# Altium schematic sheet ASM001-design-3.SchDoc
size 558 x 431 mm
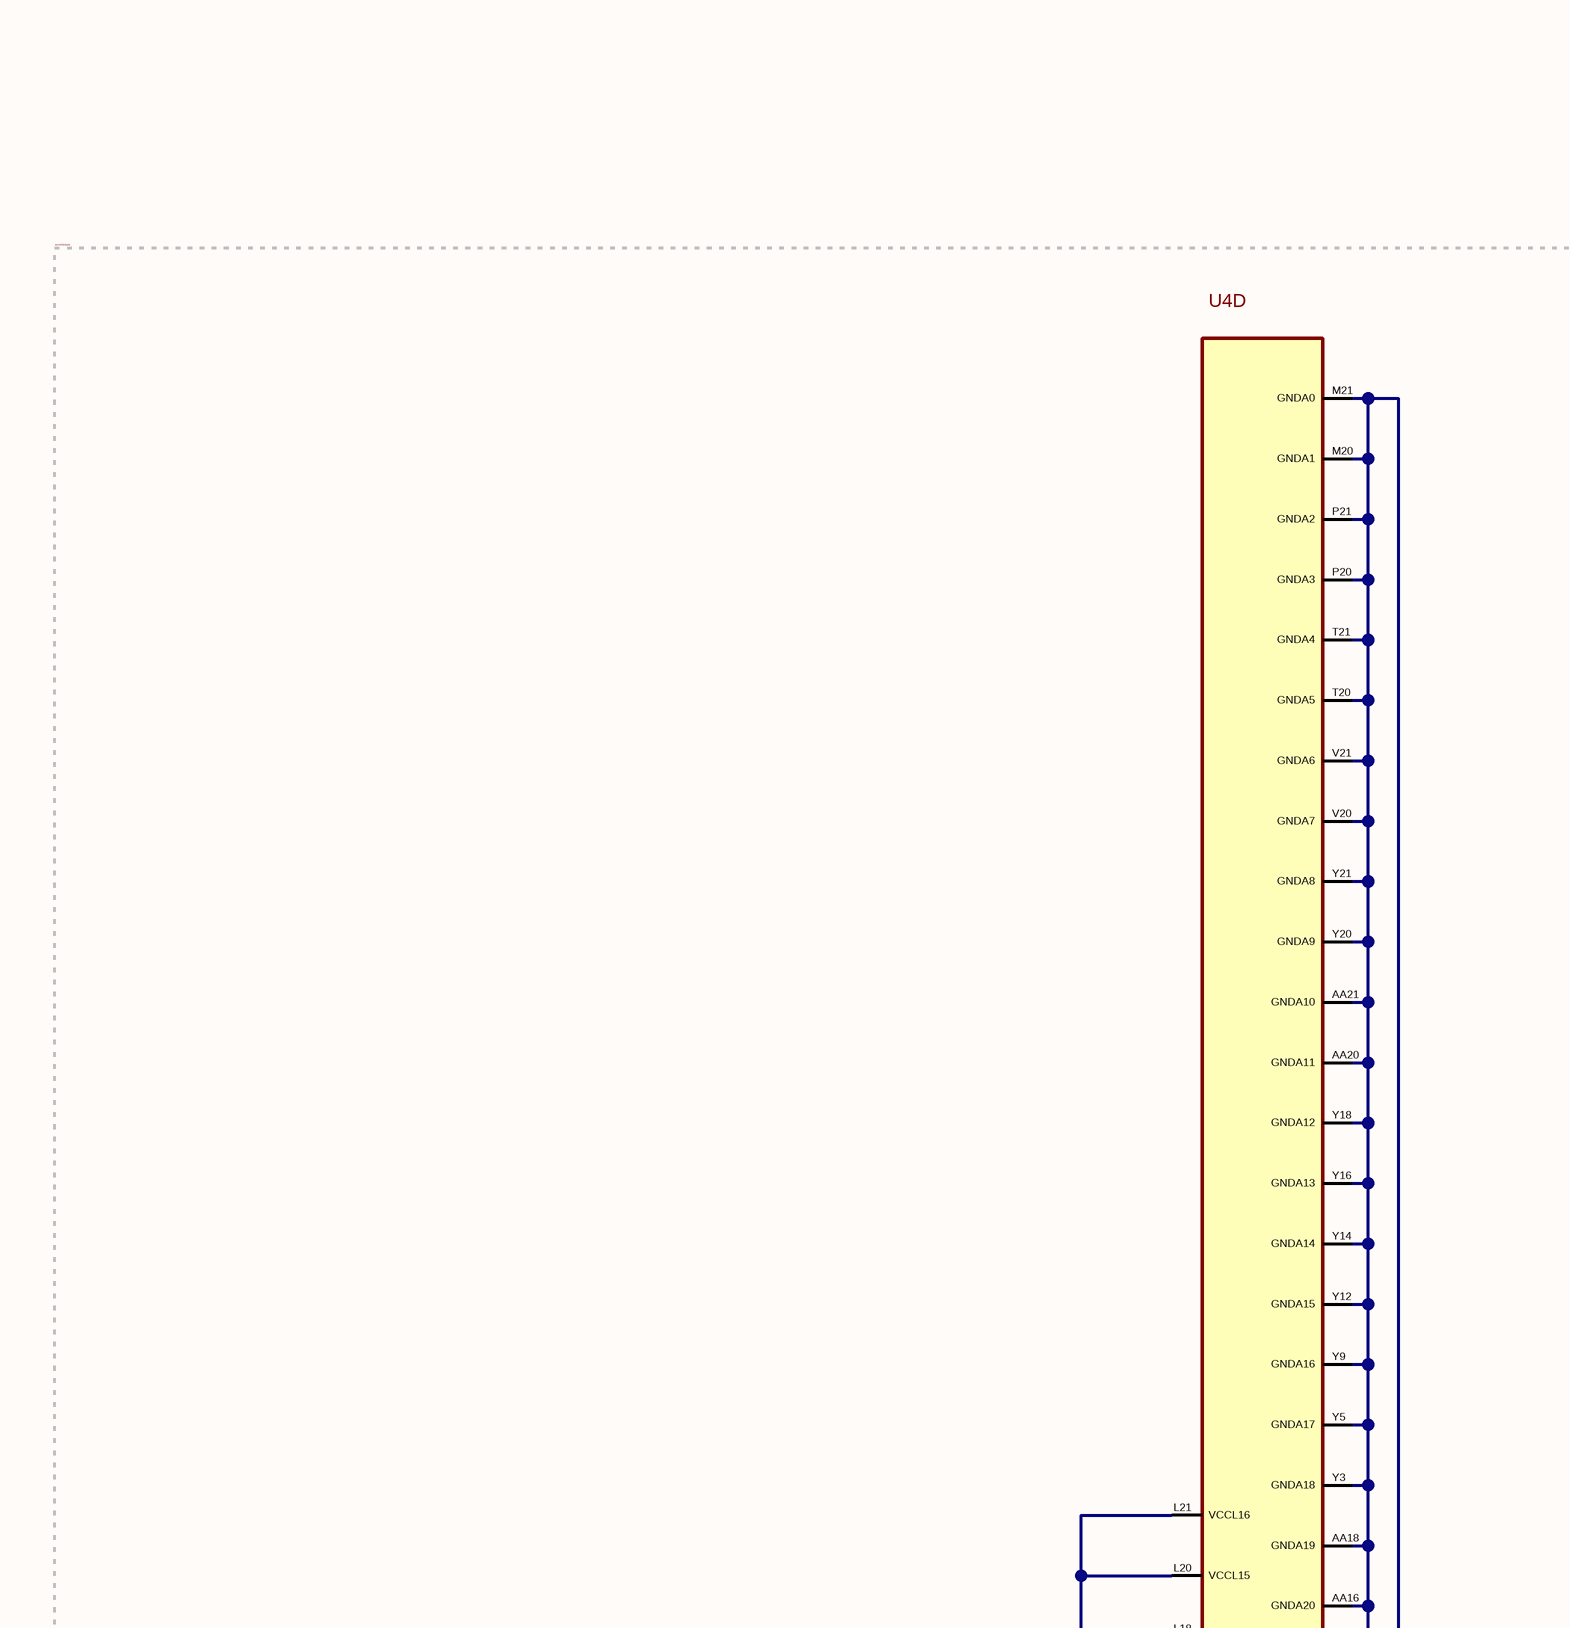
[diagram p0: ASM001-design-3.SchDoc, top column 2 of 4]
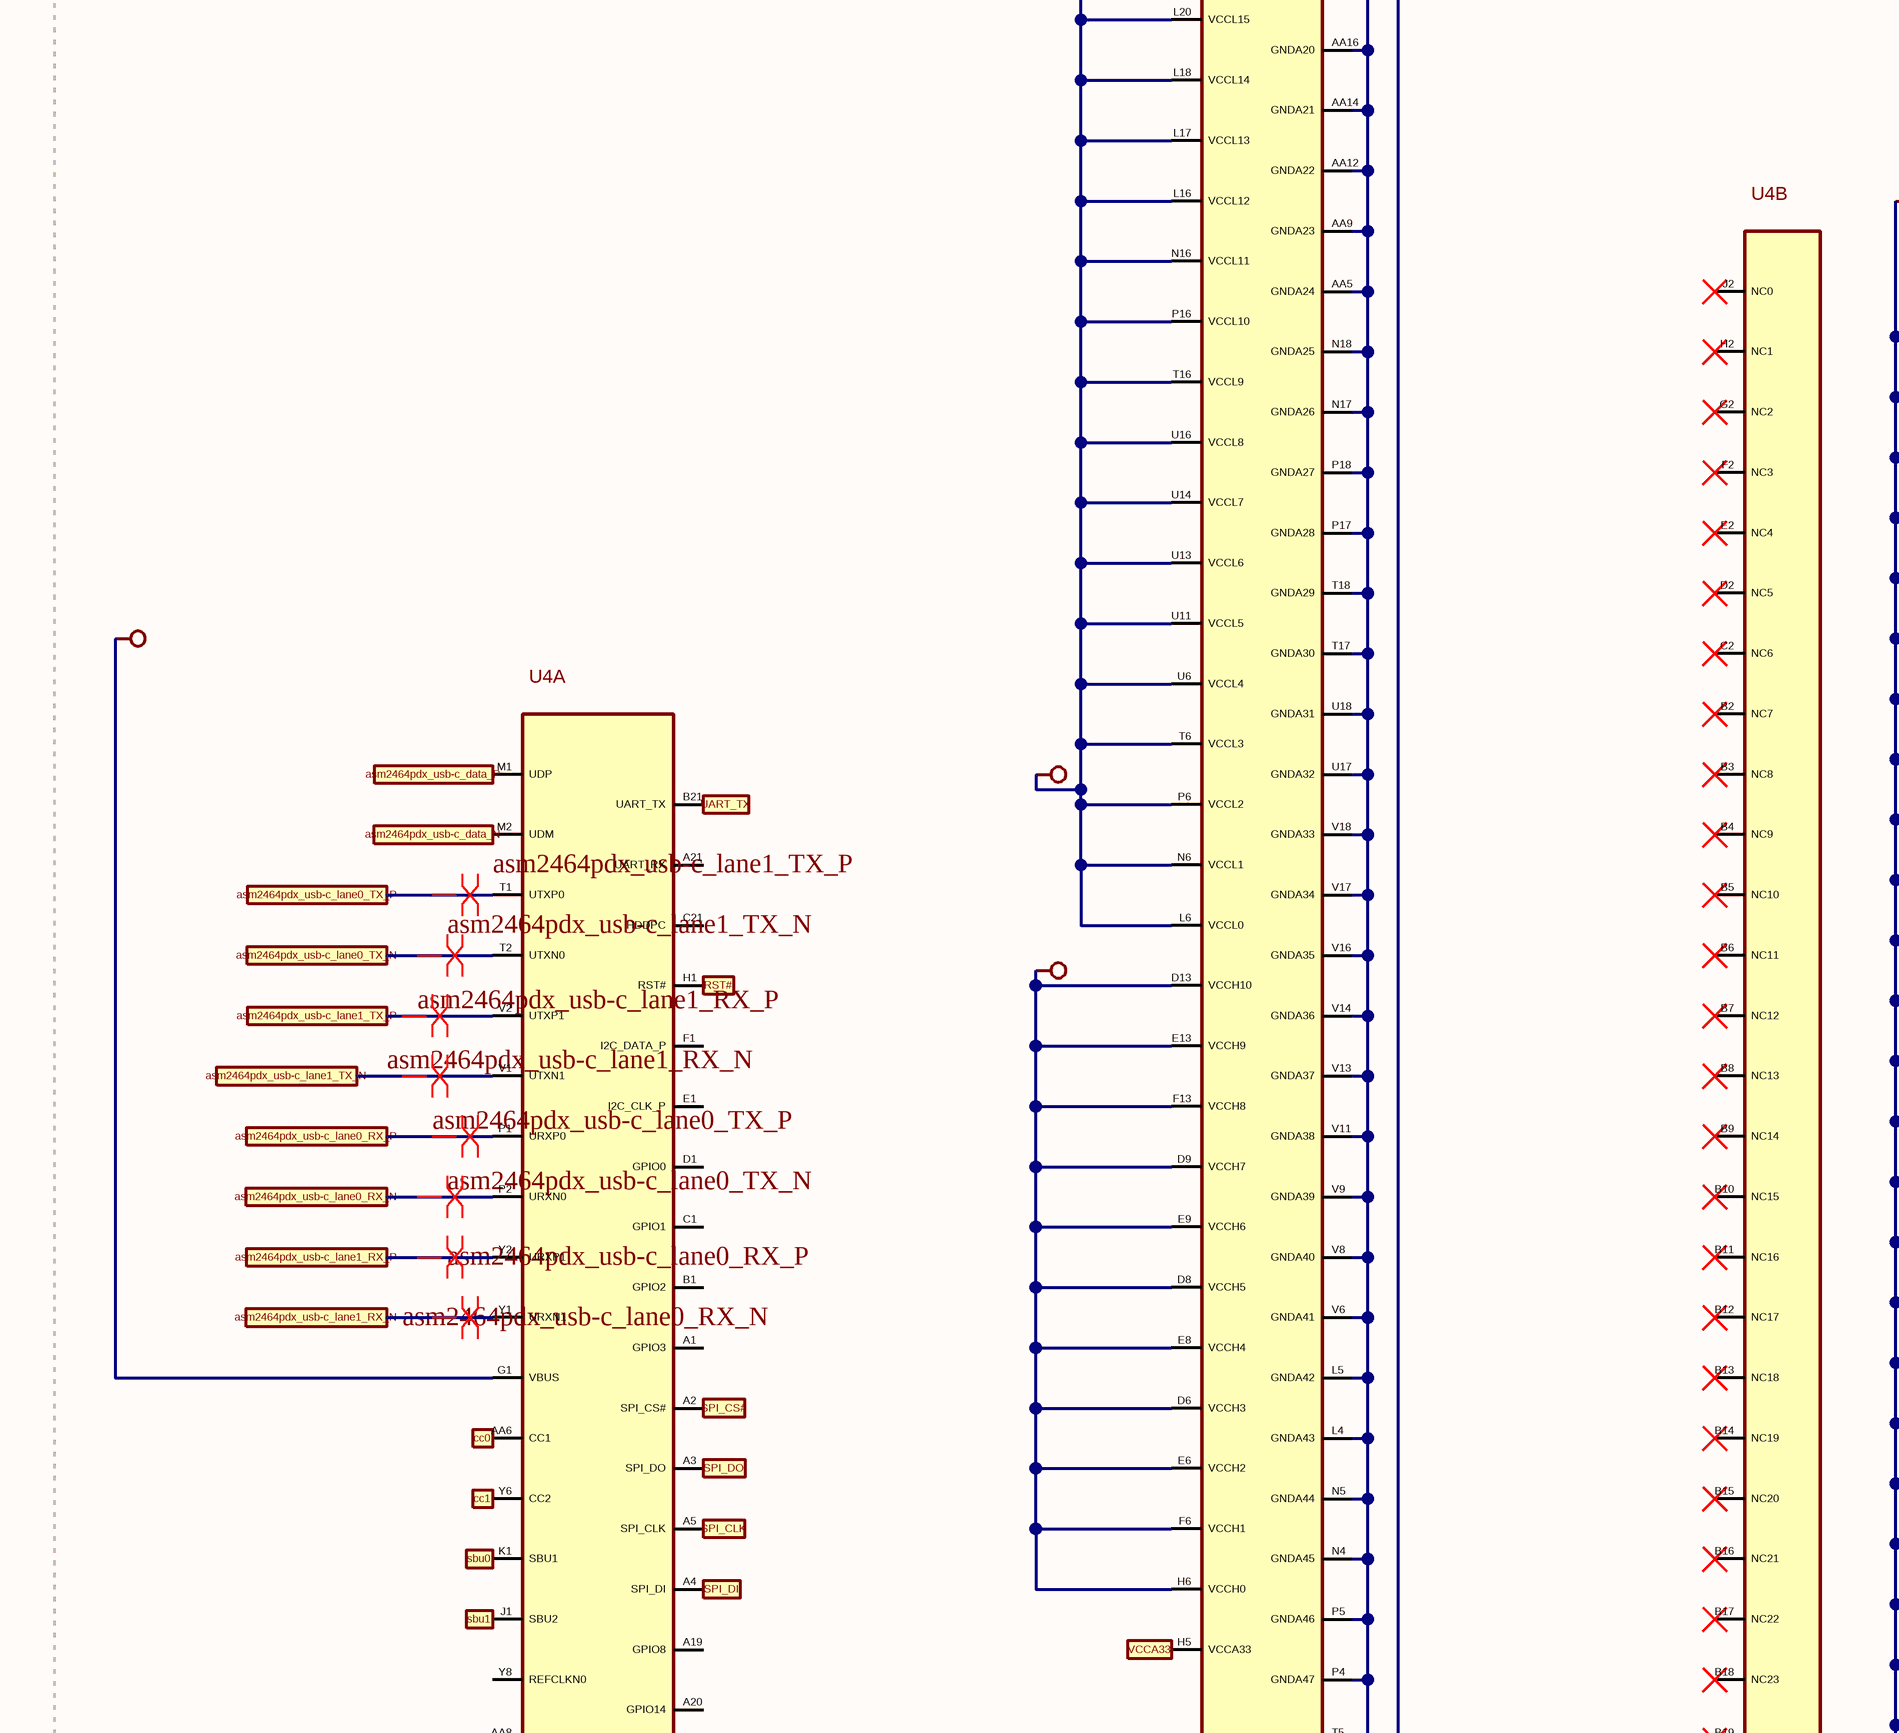
[diagram p1: ASM001-design-3.SchDoc, centre column 2 of 4]
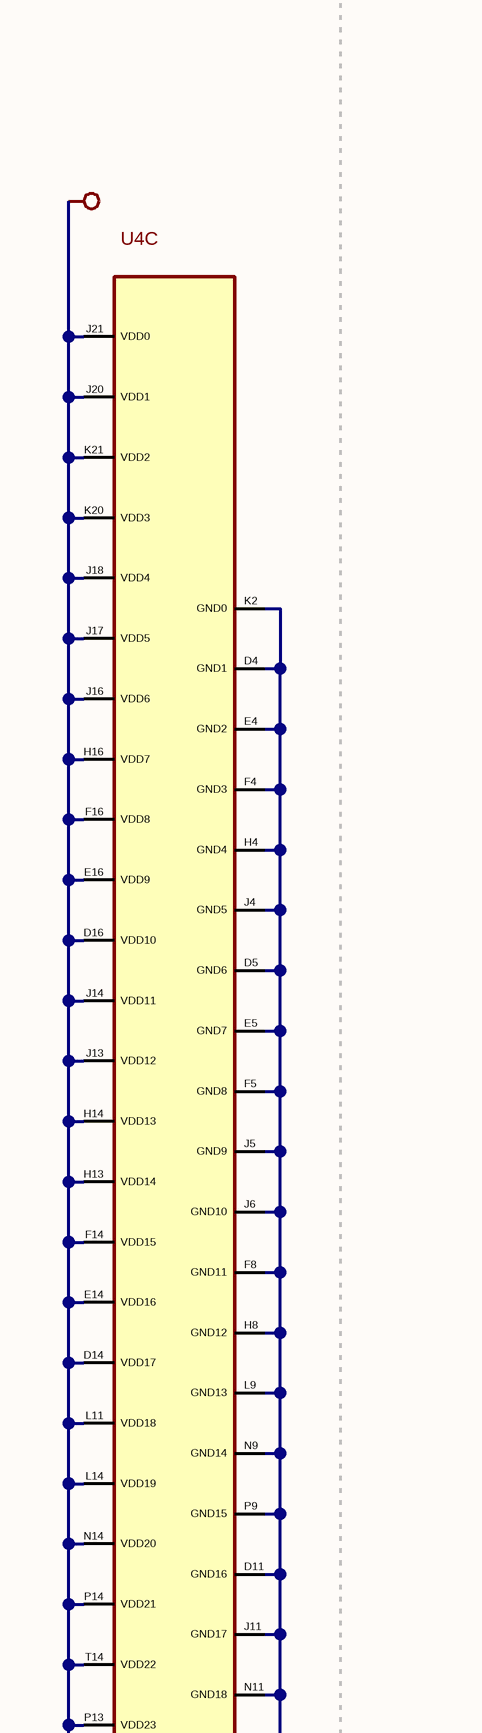
[diagram p2: ASM001-design-3.SchDoc, centre column 3 of 4]
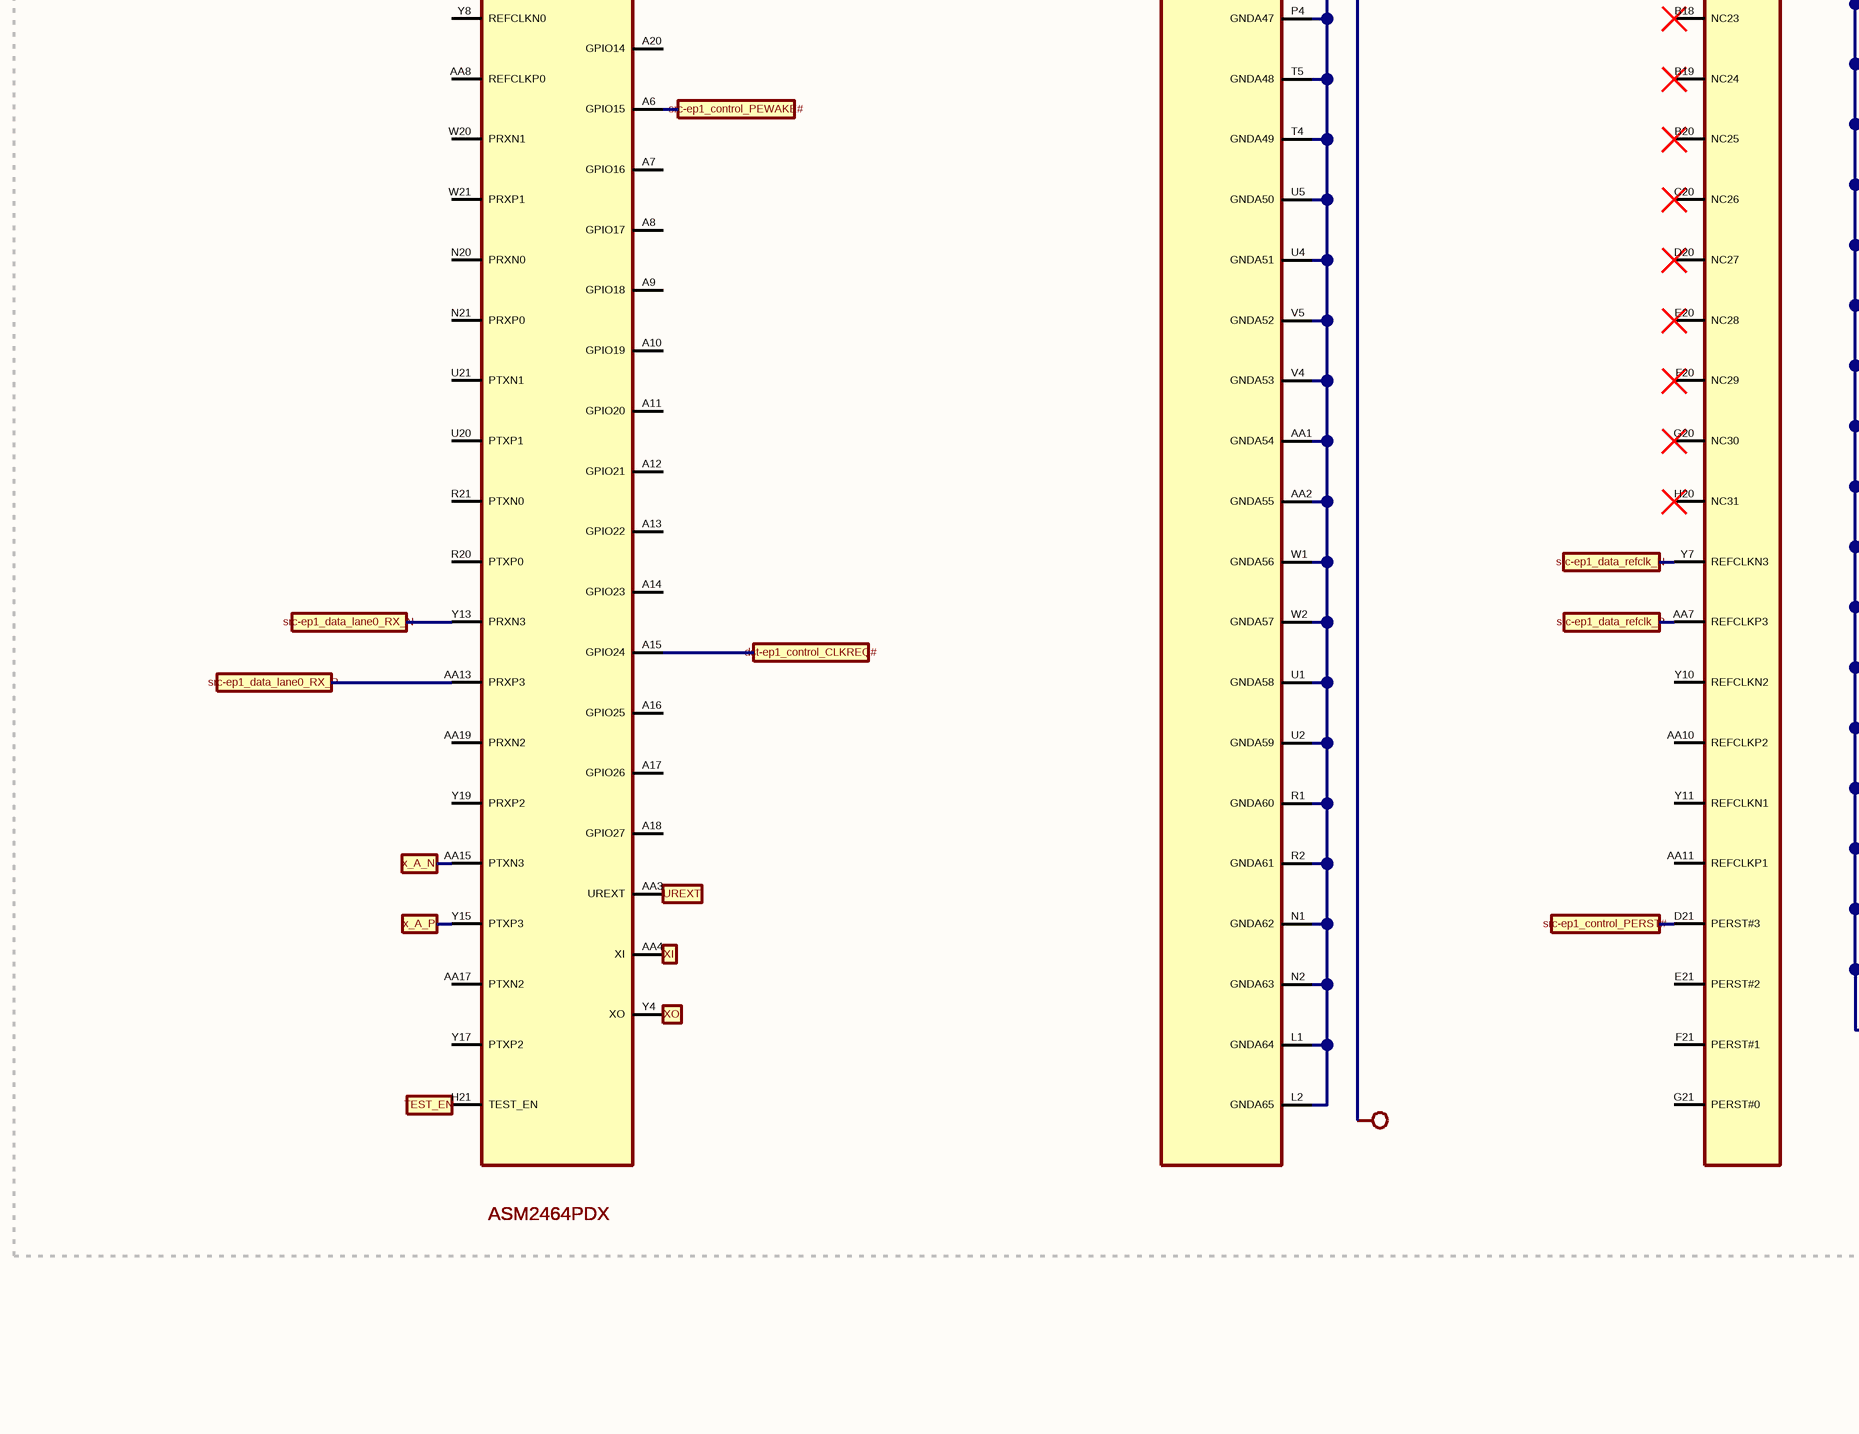
[diagram p3: ASM001-design-3.SchDoc, bottom column 2 of 4]
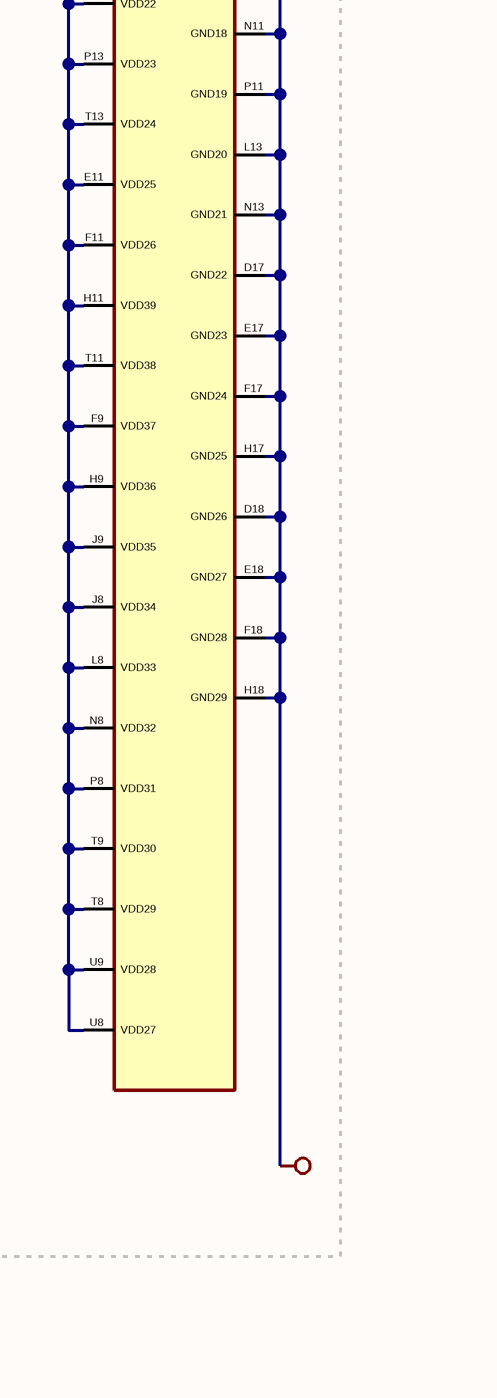
[diagram p4: ASM001-design-3.SchDoc, bottom column 3 of 4]
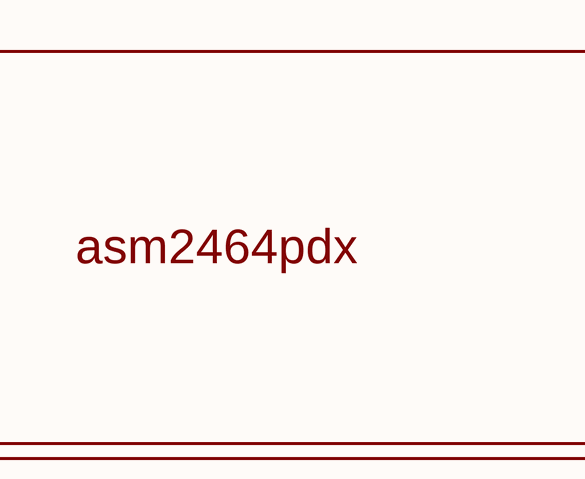
[diagram p5: ASM001-design-3.SchDoc, bottom column 4 of 4]

## Parts
U4  value ASM2464PDX  value ASM2464PDX  value ASM2464PDX  value ASM2464PDX  [BGA273N46P21X21_1000X1000X98]  (hidden comment: component$2)  (parts A,B,C,D of 4)

## Blocks framed on the sheet
asm2464pdx: U4

## Ports
asm2464pdx_usb-c_data_N, asm2464pdx_usb-c_data_P, asm2464pdx_usb-c_lane0_RX_N, asm2464pdx_usb-c_lane0_RX_P, asm2464pdx_usb-c_lane0_TX_N, asm2464pdx_usb-c_lane0_TX_P, asm2464pdx_usb-c_lane1_RX_N, asm2464pdx_usb-c_lane1_RX_P, asm2464pdx_usb-c_lane1_TX_N, asm2464pdx_usb-c_lane1_TX_P, cc0, cc1, dst-ep1_control_CLKREQ#, RST#, sbu0, sbu1, SPI_CLK, SPI_CS#, SPI_DI, SPI_DO, src-ep1_control_PERST#, src-ep1_control_PEWAKE#, src-ep1_data_lane0_RX_N, src-ep1_data_lane0_RX_P, src-ep1_data_refclk_N, src-ep1_data_refclk_P, TEST_EN, UART_TX, UREXT, VCCA33, x_A_N, x_A_P, XI, XO

## Nets
NetU4_AA1: U4.AA1(GNDA54) U4.AA2(GNDA55) U4.AA5(GNDA24) U4.AA9(GNDA23) U4.AA12(GNDA22) U4.AA14(GNDA21) U4.AA16(GNDA20) U4.AA18(GNDA19) U4.AA20(GNDA11) U4.AA21(GNDA10) U4.D4(GND1) U4.D5(GND6) U4.D6(VCCH3) U4.D8(VCCH5) U4.D9(VCCH7) U4.D11(GND16) U4.D13(VCCH10) U4.D14(VDD17) U4.D16(VDD10) U4.D17(GND22) U4.D18(GND26) U4.E4(GND2) U4.E5(GND7) U4.E6(VCCH2) U4.E8(VCCH4) U4.E9(VCCH6) U4.E11(VDD25) U4.E13(VCCH9) U4.E14(VDD16) U4.E16(VDD9) U4.E17(GND23) U4.E18(GND27) U4.F4(GND3) U4.F5(GND8) U4.F6(VCCH1) U4.F8(GND11) U4.F9(VDD37) U4.F11(VDD26) U4.F13(VCCH8) U4.F14(VDD15) U4.F16(VDD8) U4.F17(GND24) U4.F18(GND28) U4.G1(VBUS) U4.H4(GND4) U4.H6(VCCH0) U4.H8(GND12) U4.H9(VDD36) U4.H11(VDD39) U4.H13(VDD14) U4.H14(VDD13) U4.H16(VDD7) U4.H17(GND25) U4.H18(GND29) U4.J4(GND5) U4.J5(GND9) U4.J6(GND10) U4.J8(VDD34) U4.J9(VDD35) U4.J11(GND17) U4.J13(VDD12) U4.J14(VDD11) U4.J16(VDD6) U4.J17(VDD5) U4.J18(VDD4) U4.J20(VDD1) U4.J21(VDD0) U4.K2(GND0) U4.K20(VDD3) U4.K21(VDD2) U4.L1(GNDA64) U4.L2(GNDA65) U4.L4(GNDA43) U4.L5(GNDA42) U4.L6(VCCL0) U4.L8(VDD33) U4.L9(GND13) U4.L11(VDD18) U4.L13(GND20) U4.L14(VDD19) U4.L16(VCCL12) U4.L17(VCCL13) U4.L18(VCCL14) U4.L20(VCCL15) U4.L21(VCCL16) U4.M20(GNDA1) U4.M21(GNDA0) U4.N1(GNDA62) U4.N2(GNDA63) U4.N4(GNDA45) U4.N5(GNDA44) U4.N6(VCCL1) U4.N8(VDD32) U4.N9(GND14) U4.N11(GND18) U4.N13(GND21) U4.N14(VDD20) U4.N16(VCCL11) U4.N17(GNDA26) U4.N18(GNDA25) U4.P4(GNDA47) U4.P5(GNDA46) U4.P6(VCCL2) U4.P8(VDD31) U4.P9(GND15) U4.P11(GND19) U4.P13(VDD23) U4.P14(VDD21) U4.P16(VCCL10) U4.P17(GNDA28) U4.P18(GNDA27) U4.P20(GNDA3) U4.P21(GNDA2) U4.R1(GNDA60) U4.R2(GNDA61) U4.T4(GNDA49) U4.T5(GNDA48) U4.T6(VCCL3) U4.T8(VDD29) U4.T9(VDD30) U4.T11(VDD38) U4.T13(VDD24) U4.T14(VDD22) U4.T16(VCCL9) U4.T17(GNDA30) U4.T18(GNDA29) U4.T20(GNDA5) U4.T21(GNDA4) U4.U1(GNDA58) U4.U2(GNDA59) U4.U4(GNDA51) U4.U5(GNDA50) U4.U6(VCCL4) U4.U8(VDD27) U4.U9(VDD28) U4.U11(VCCL5) U4.U13(VCCL6) U4.U14(VCCL7) U4.U16(VCCL8) U4.U17(GNDA32) U4.U18(GNDA31) U4.V4(GNDA53) U4.V5(GNDA52) U4.V6(GNDA41) U4.V8(GNDA40) U4.V9(GNDA39) U4.V11(GNDA38) U4.V13(GNDA37) U4.V14(GNDA36) U4.V16(GNDA35) U4.V17(GNDA34) U4.V18(GNDA33) U4.V20(GNDA7) U4.V21(GNDA6) U4.W1(GNDA56) U4.W2(GNDA57) U4.Y3(GNDA18) U4.Y5(GNDA17) U4.Y9(GNDA16) U4.Y12(GNDA15) U4.Y14(GNDA14) U4.Y16(GNDA13) U4.Y18(GNDA12) U4.Y20(GNDA9) U4.Y21(GNDA8)
asm2464pdx_usb-c_data_N: U4.M2(UDM) ; port asm2464pdx_usb-c_data_N
asm2464pdx_usb-c_data_P: U4.M1(UDP) ; port asm2464pdx_usb-c_data_P
asm2464pdx_usb-c_lane0_TX_N: U4.T2(UTXN0) ; port asm2464pdx_usb-c_lane0_TX_N
asm2464pdx_usb-c_lane0_TX_N: U4.P2(URXN0) ; port asm2464pdx_usb-c_lane0_RX_N  [a separate net that carries the same name]
asm2464pdx_usb-c_lane0_TX_P: U4.T1(UTXP0) ; port asm2464pdx_usb-c_lane0_TX_P
asm2464pdx_usb-c_lane0_TX_P: U4.P1(URXP0) ; port asm2464pdx_usb-c_lane0_RX_P  [a separate net that carries the same name]
asm2464pdx_usb-c_lane1_RX_N: U4.V1(UTXN1) ; port asm2464pdx_usb-c_lane1_TX_N
asm2464pdx_usb-c_lane1_RX_N: U4.Y1(URXN1) ; port asm2464pdx_usb-c_lane1_RX_N  [a separate net that carries the same name]
asm2464pdx_usb-c_lane1_RX_P: U4.V2(UTXP1) ; port asm2464pdx_usb-c_lane1_TX_P
asm2464pdx_usb-c_lane1_RX_P: U4.Y2(URXP1) ; port asm2464pdx_usb-c_lane1_RX_P  [a separate net that carries the same name]
cc0: U4.AA6(CC1) ; port cc0
cc1: U4.Y6(CC2) ; port cc1
dst-ep1_control_CLKREQ#: U4.A15(GPIO24) ; port dst-ep1_control_CLKREQ#
RST#: U4.H1(RST#) ; port RST#
sbu0: U4.K1(SBU1) ; port sbu0
sbu1: U4.J1(SBU2) ; port sbu1
SPI_CLK: U4.A5(SPI_CLK) ; port SPI_CLK
SPI_CS#: U4.A2(SPI_CS#) ; port SPI_CS#
SPI_DI: U4.A4(SPI_DI) ; port SPI_DI
SPI_DO: U4.A3(SPI_DO) ; port SPI_DO
src-ep1_control_PERST#: U4.D21(PERST#3) ; port src-ep1_control_PERST#
src-ep1_control_PEWAKE#: U4.A6(GPIO15) ; port src-ep1_control_PEWAKE#
src-ep1_data_lane0_RX_N: U4.Y13(PRXN3) ; port src-ep1_data_lane0_RX_N
src-ep1_data_lane0_RX_P: U4.AA13(PRXP3) ; port src-ep1_data_lane0_RX_P
src-ep1_data_refclk_N: U4.Y7(REFCLKN3) ; port src-ep1_data_refclk_N
src-ep1_data_refclk_P: U4.AA7(REFCLKP3) ; port src-ep1_data_refclk_P
TEST_EN: U4.H21(TEST_EN) ; port TEST_EN
UART_TX: U4.B21(UART_TX) ; port UART_TX
UREXT: U4.AA3(UREXT) ; port UREXT
VCCA33: U4.H5(VCCA33) ; port VCCA33
x_A_N: U4.AA15(PTXN3) ; port x_A_N
x_A_P: U4.Y15(PTXP3) ; port x_A_P
XI: U4.AA4(XI) ; port XI
XO: U4.Y4(XO) ; port XO

Not connected (* = marked no-connect by the designer): U4 A1(GPIO3) A7(GPIO16) A8(GPIO17) A9(GPIO18) A10(GPIO19) A11(GPIO20) A12(GPIO21) A13(GPIO22) A14(GPIO23) A16(GPIO25) A17(GPIO26) A18(GPIO27) A19(GPIO8) A20(GPIO14) A21(UART_RX) AA8(REFCLKP0) AA10(REFCLKP2) AA11(REFCLKP1) AA17(PTXN2) AA19(PRXN2) B1(GPIO2) B2(NC7)* B3(NC8)* B4(NC9)* B5(NC10)* B6(NC11)* B7(NC12)* B8(NC13)* B9(NC14)* B10(NC15)* B11(NC16)* B12(NC17)* B13(NC18)* B14(NC19)* B15(NC20)* B16(NC21)* B17(NC22)* B18(NC23)* B19(NC24)* B20(NC25)* C1(GPIO1) C2(NC6)* C20(NC26)* C21(HDDPC) D1(GPIO0) D2(NC5)* D20(NC27)* E1(I2C_CLK_P) E2(NC4)* E20(NC28)* E21(PERST#2) F1(I2C_DATA_P) F2(NC3)* F20(NC29)* F21(PERST#1) G2(NC2)* G20(NC30)* G21(PERST#0) H2(NC1)* H20(NC31)* J2(NC0)* N20(PRXN0) N21(PRXP0) R20(PTXP0) R21(PTXN0) U20(PTXP1) U21(PTXN1) W20(PRXN1) W21(PRXP1) Y8(REFCLKN0) Y10(REFCLKN2) Y11(REFCLKN1) Y17(PTXP2) Y19(PRXP2)

## Layout directives
differential pair: asm2464pdx_usb-c_lane0_TX_N, asm2464pdx_usb-c_lane0_TX_P, asm2464pdx_usb-c_lane1_RX_N, asm2464pdx_usb-c_lane1_RX_P

## Notes on the sheet
- asm2464pdx
- Labels drawn without touching a wire or pin: asm2464pdx_usb-c_lane0_RX_N, asm2464pdx_usb-c_lane0_RX_P, asm2464pdx_usb-c_lane1_TX_N, asm2464pdx_usb-c_lane1_TX_P

## Library data of the parts
U4 = component$2: REFERENCE: false; FOOTPRINT: ASM001-design:BGA273N46P21X21_1000X1000X98; MPN: ASM2464PDX